# EAGLE design Un_SecUSB_3 (EAGLE 7.1.0)
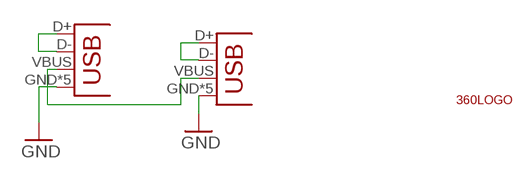
[diagram p0: schematic, sheet 1]

## Parts
U$1  360LOGO_0.8  [360LOGO_0.8]
X2  USB_4-A-H_3  [USB-A-H_3]
X3  USB_4_4  [USB-A-4]

## Nets
GND: X2.GND X2.P$1(GND) X2.P$2(GND) X2.P$3(GND) X2.P$4(GND) X3.GND X3.P$5(GND) X3.P$6(GND) X3.P$7(GND) X3.P$8(GND)
N$1: X2.VBUS X3.VBUS
N$2: X2.D+ X2.D-
N$3: X3.D+ X3.D-

## Library data of the parts
U$1 = 2SparkFun:360LOGO
X2 X3 = 2SparkFun:USB_4: USB Connectors USB-B-PTH is fully proven SKU : PRT-00139 USB-miniB is fully proven SKU : PRT-00587 USB-A-PCB is untested. USB-A-H is throughly reviewed, but untested. Spark Fun Electronics SKU : PRT-00437 USB-B-SMT is throughly reviewed, but untested. Needs silkscreen touching up. USB-A-S has not been used/tested USB-MB-H has not been used/tested

## Board
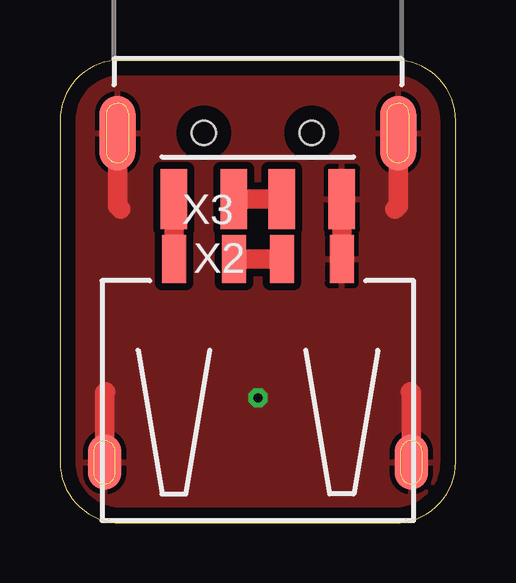
[diagram p1: board, top side]
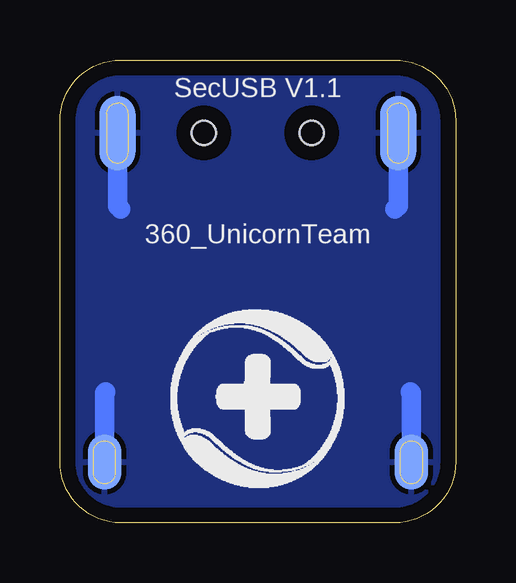
[diagram p2: board, bottom side, seen from below]

Size 16.51 x 19.3 mm. Coordinates in mm from the lower left corner, seen from the top.
Outline: 13.97,19.3 2.54,19.3 arc90 0,16.76 0,2.54 arc90 2.54,0 13.97,0 arc90 16.51,2.54 16.51,16.76 arc90 13.97,19.3
Copper layers (1*16): Top 0.035mm / dielectric 1.5mm / Bottom 0.035mm
Design rules "yun": minimum track width 8mil, minimum drill 15mil, track to track 8mil, track to pad 8mil, pad to pad 8mil, via to via 8mil, smd to smd 8mil, copper to edge 25mil, drill to drill 8mil, minimum pad ring 10mil, minimum via ring 8mil, stop-mask expansion 4mil, vias tented up to drill 20mil, thermal gap 8mil

### Footprints (pad centres in the part's own frame; a part is rotated, then mirrored left to right if it is on the bottom)
USB-A-H_3 = smd 2.5 x 1.1: D+ 2.75,1; D- 2.75,-1; GND 2.75,3.5; VBUS 2.75,-3.5 | smd 3.1 x 1.5: P$1 0,-5.85; P$2 0,5.85 | smd 3.1 x 1.5 bottom: P$3 0,5.85; P$4 0,-5.85 | hole 1: 0,2.25; 0,-2.25
USB-A-4 = smd 1 x 2: D+ 1,4.9; D- -1,4.9; GND 3.5,4.9; VBUS -3.5,4.9 | smd 1.4 x 2.3 bottom: P$5 -6.4,-3.57; P$6 6.4,-3.57 | smd 1.4 x 2.3: P$7 -6.4,-3.57; P$8 6.4,-3.57

### Placement (x,y rotation side)
U$1  8.26,5.21 0 bottom
X2  8.26,16.26 270 top
X3  8.26,6.1 0 top

### Tracks (layer width: path | path; a pad name or v marks a point on that pad's centre or on a via)
GND  (via drill 0.38)
  Top 0.813: X3.GND X2.GND | X2.P$4 2.41,13.22 2.54,13.08 | X2.P$3 14.11,13.22 13.97,13.08 | X3.P$7 1.86,5.41 1.91,5.46 | X3.P$8 14.66,5.41 14.61,5.46
  Bottom 0.813: X2.P$4 2.41,13.22 2.54,13.08 | X2.P$3 14.11,13.22 13.97,13.08 | X3.P$8 14.66,5.41 14.61,5.46 | X3.P$7 1.86,5.41 1.91,5.46
  other vias: 8.26,5.21
  pour Bottom (isolate 0.305, rank 2): 0,19.3 0,0 16.51,0 16.51,19.3
  pour Top (isolate 0.305, rank 2): 16.51,19.3 0,19.3 0,0 16.51,0
N$1
  Top 0.813: X2.VBUS X3.VBUS
N$2
  Top 0.813: X2.D- X2.D+
N$3
  Top 0.813: X3.D- X3.D+

### Text on the board
bPlace: SecUSB V1.1 | 360_UnicornTeam